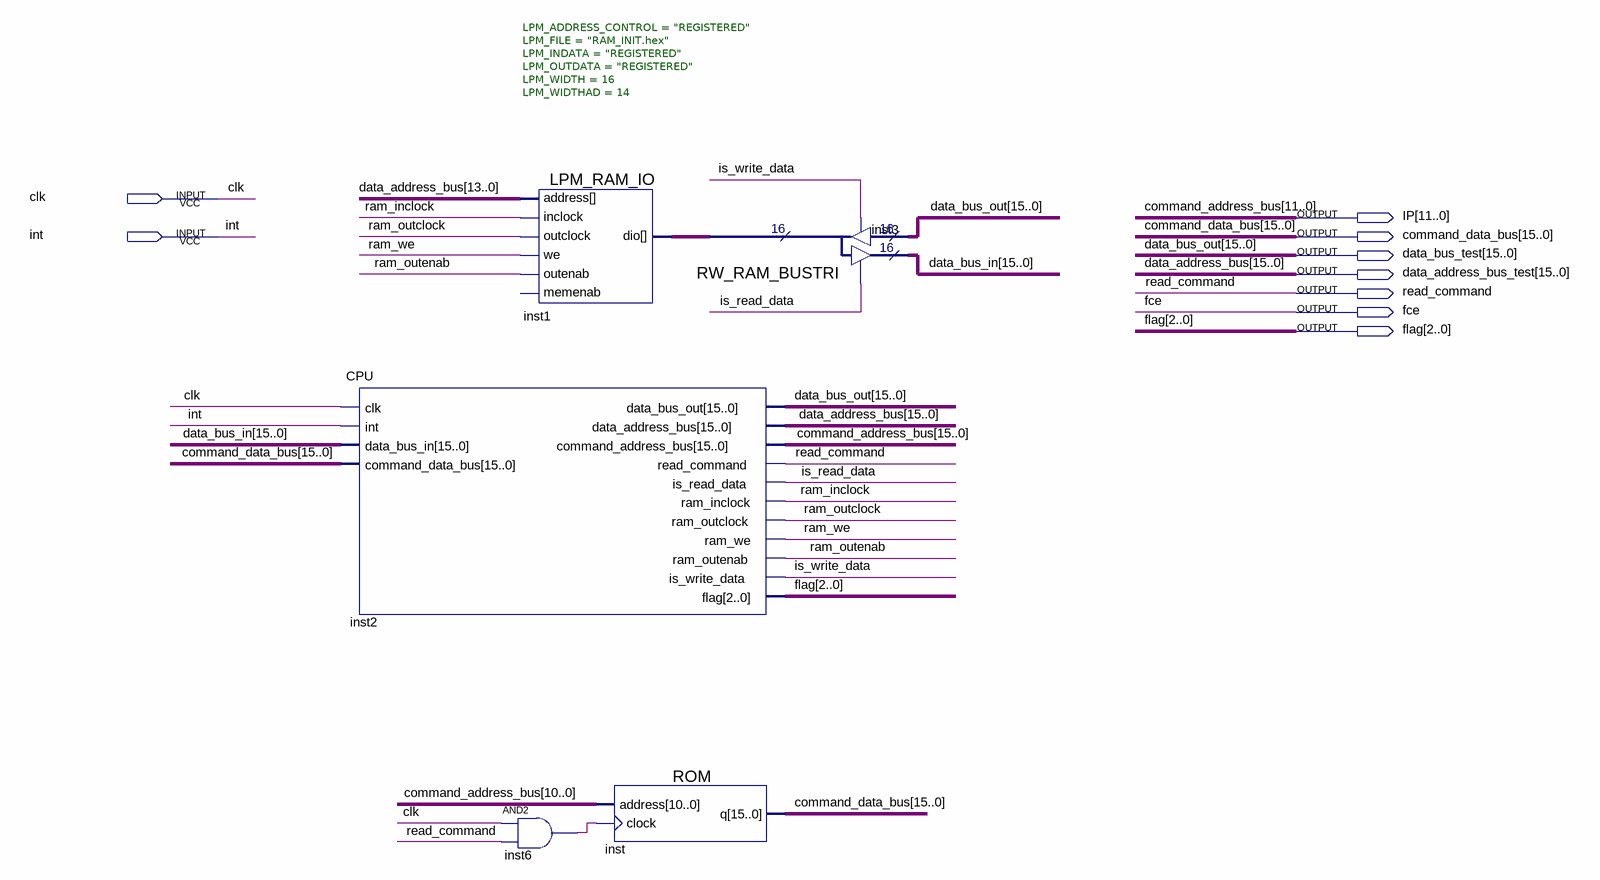
[diagram p0: schematic sheet]
// Quartus schematic CPU_WITH_MEMORY.bdf as structural Verilog: 5 symbols, 9 pins
module CPU_WITH_MEMORY (
  input  clk,
  input  \int ,
  output [11:0] IP,
  output [15:0] command_data_bus,
  output [15:0] data_bus_test,
  output [15:0] data_address_bus_test,
  output read_command,
  output fce,
  output [2:0] flag
);

  wire inst6_out, is_read_data, is_write_data, ram_inclock, ram_outclock, ram_outenab, ram_we;
  wire [15:0] data_bus_in, inst1_dio;
  wire [15:12] command_address_bus;

  CPU inst2 (
    .clk(clk), .\int (\int ), .data_bus_in(data_bus_in), .command_data_bus(command_data_bus),
    .data_bus_out(data_bus_test), .data_address_bus(data_address_bus_test),
    .command_address_bus({command_address_bus, IP}), .read_command(read_command),
    .is_read_data(is_read_data), .ram_inclock(ram_inclock), .ram_outclock(ram_outclock), .ram_we(ram_we),
    .ram_outenab(ram_outenab), .is_write_data(is_write_data), .flag(flag));
  LPM_RAM_IO #(.LPM_ADDRESS_CONTROL("REGISTERED"), .LPM_FILE("RAM_INIT.hex"), .LPM_INDATA("REGISTERED"), .LPM_OUTDATA("REGISTERED"), .LPM_WIDTH(16), .LPM_WIDTHAD(14)) inst1 (
    .address(data_address_bus_test[13:0]), .outclock(ram_outclock), .inclock(ram_inclock), .we(ram_we),
    .outenab(ram_outenab), .dio(inst1_dio));  // open: memenab
  and inst6 (inst6_out, clk, read_command);
  ROM inst (.address(IP[10:0]), .clock(inst6_out), .q(command_data_bus));
  RW_RAM_BUSTRI inst3 (
    .enabledt(is_write_data), .data(data_bus_test), .enabletr(is_read_data), .result(data_bus_in),
    .tridata(inst1_dio));

  // Other names for the same wires on the sheet: command_address_bus[11:0] = IP;
  //   data_address_bus[15:0] = data_address_bus_test; data_bus_out[15:0] = data_bus_test
endmodule
